# EAGLE design Pi (EAGLE 7.6.0)
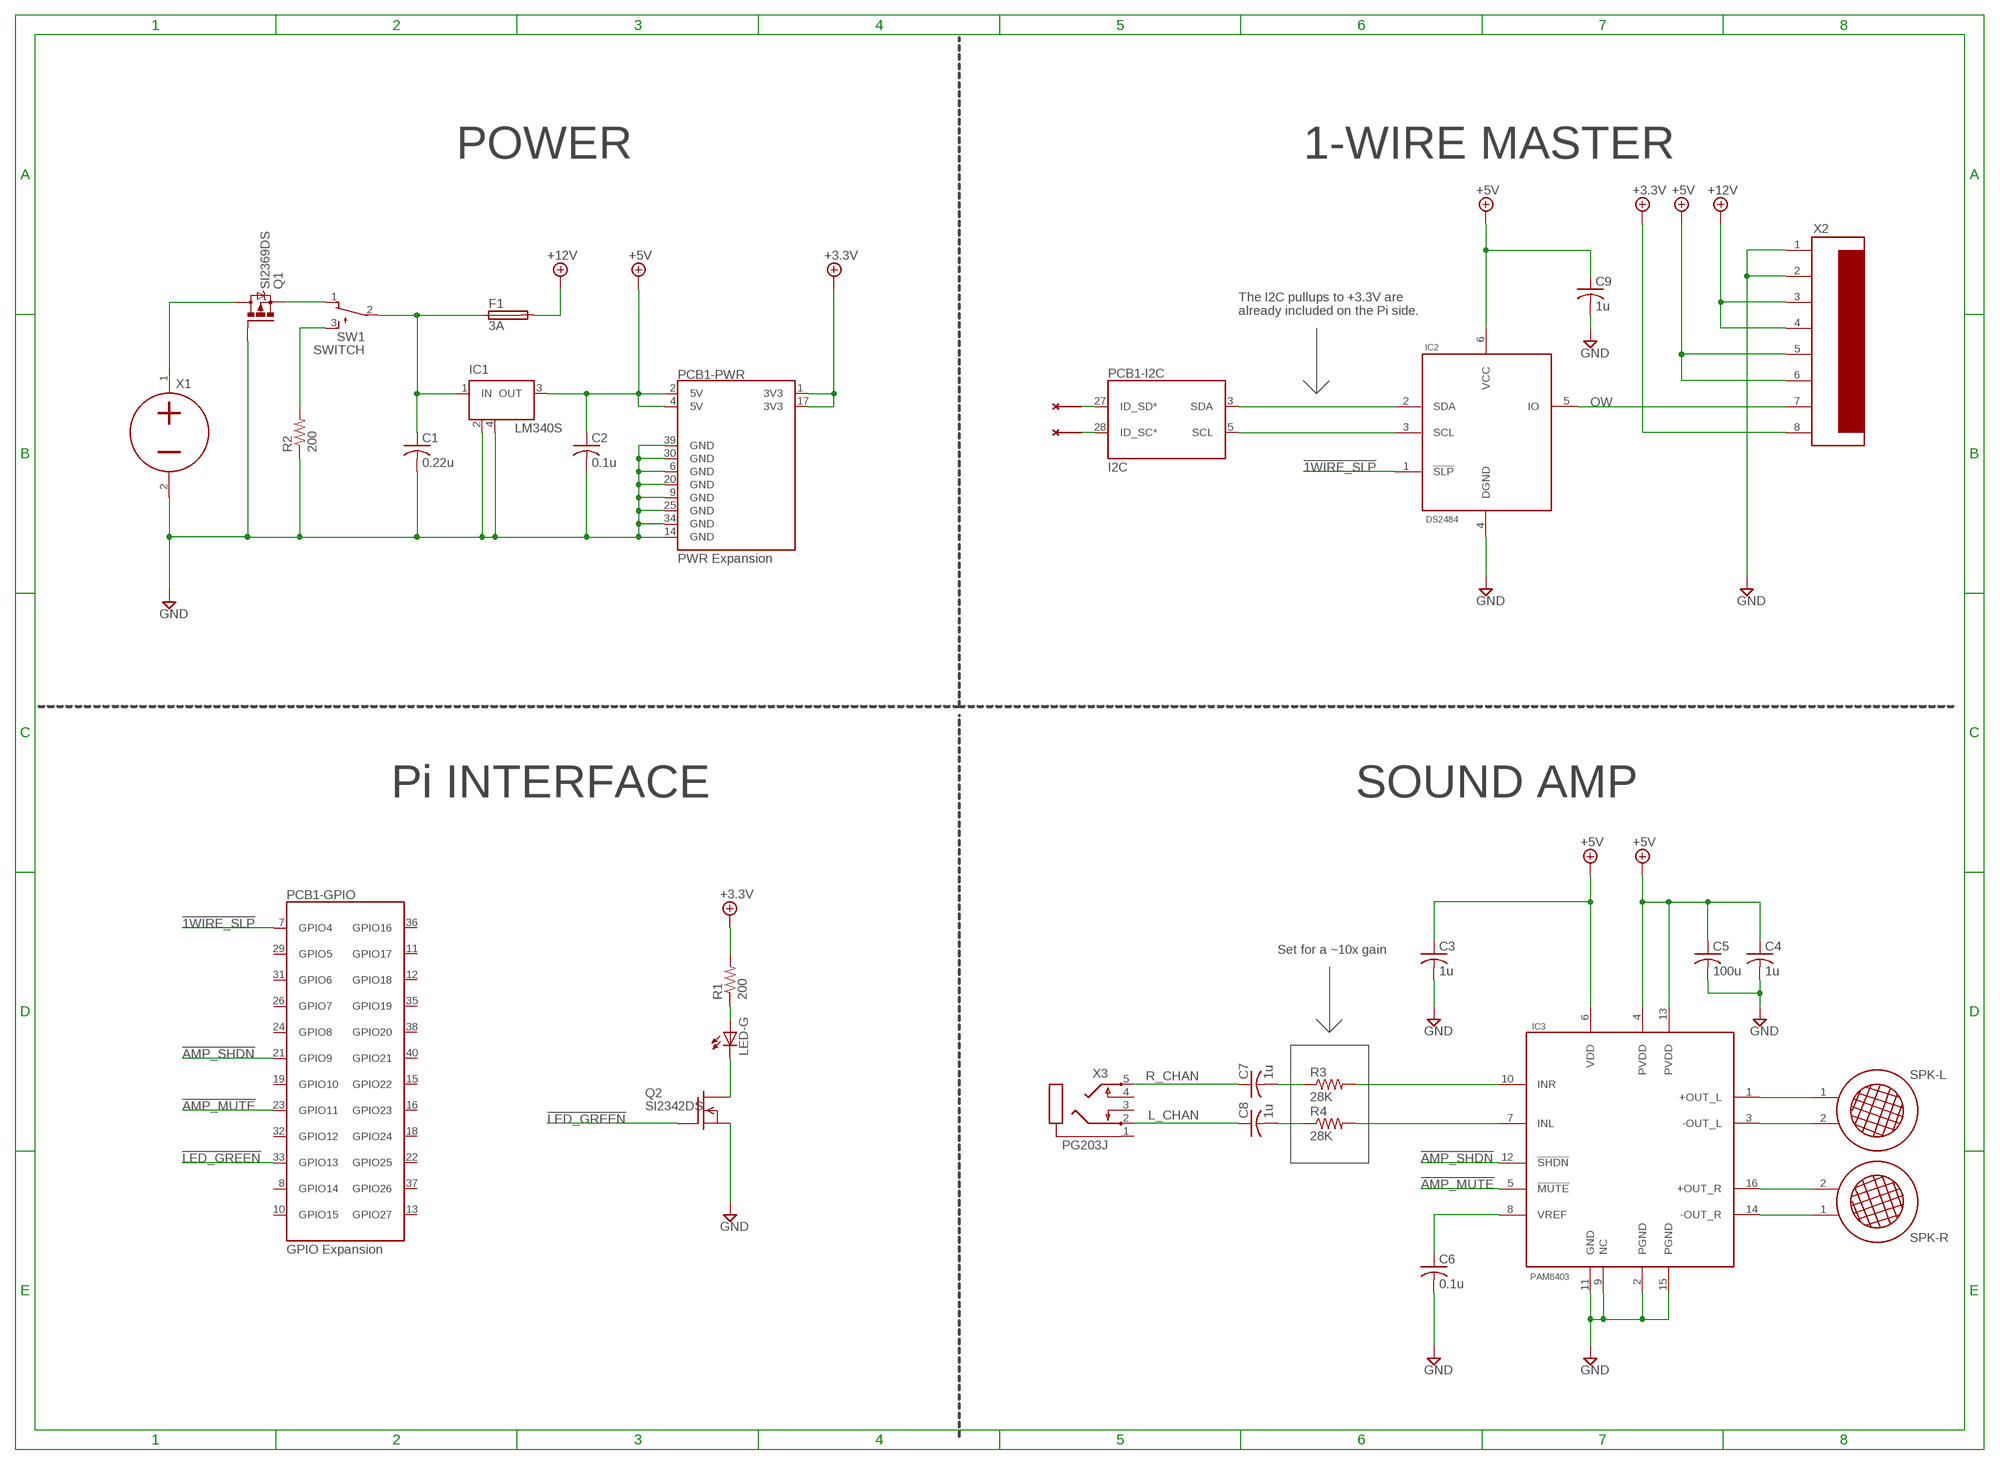
[diagram p0: schematic, sheet 1]

## Parts
C1  0.22u  C-USC0603  [C0603]
C2  0.1u  C-USC0603  [C0603]
C3  1u  C-USC0603  [C0603]
C4  1u  C-USC0603  [C0603]
C5  100u  C-USC0805  [C0805]
C6  0.1u  C-USC0603  [C0603]
C7  1u  C-USC0603  [C0603]
C8  1u  C-USC0603  [C0603]
C9  1u  C-USC0603  [C0603]
F1  3A  0603SFP300F  [F0603]
IC1  LM340S  [SOT223]
IC2  DS2484  [SOT23-6L]
IC3  PAM8403  [SOP16]
LED-G  LEDCHIP-LED0603  [CHIP-LED0603]
NC1  NC  (no package)
NC2  NC  (no package)
PCB1  RPI3  [RPI3]
Q1  SI2369DS  [SOT23]
Q2  SI2342DS  [SOT23]
R1  200  R-US_R0603  [R0603]
R2  200  R-US_R0603  [R0603]
R3  28K  R-US_R0603  [R0603]
R4  28K  R-US_R0603  [R0603]
SPK-L  SPEAKER  [KK-156-2]
SPK-R  SPEAKER  [KK-156-2]
SW1  SWITCH  [KK-156-3]
X1  SUPPLY_12V  [KK-156-2]
X2  1WIRE-CON  [KK-156-8]
X3  PG203J  [PG203J]

## Nets
!1WIRE_SLP: IC2.1(!SLP) PCB1.7(-GPIO:GPIO4)
!AMP_MUTE: IC3.5(!MUTE) PCB1.23(-GPIO:GPIO11)
!AMP_SHDN: IC3.12(!SHDN) PCB1.21(-GPIO:GPIO9)
!LED_GREEN: PCB1.33(-GPIO:GPIO13) Q2.1(G)
+3P3V: PCB1.1(-PWR:3V3) PCB1.17(-PWR:3V3) R1.2 X2.8 ; supply symbol labelled +3.3V
+5V: C2.1 C3.1 C4.1 C5.1 C9.1 IC1.3(OUT) IC2.6(VCC) IC3.4(PVDD) IC3.6(VDD) IC3.13(PVDD) PCB1.2(-PWR:5V) PCB1.4(-PWR:5V) X2.5 X2.6
+12V: F1.2 X2.3 X2.4
GND: C1.2 C2.2 C3.2 C4.2 C5.2 C6.2 C9.2 IC1.2(GND) IC1.4(GND) IC2.4(DGND) IC3.2(PGND) IC3.9(NC) IC3.11(GND) IC3.15(PGND) PCB1.6(-PWR:GND) PCB1.9(-PWR:GND) PCB1.14(-PWR:GND) PCB1.20(-PWR:GND) PCB1.25(-PWR:GND) PCB1.30(-PWR:GND) PCB1.34(-PWR:GND) PCB1.39(-PWR:GND) Q1.1(G) Q2.2(S) R2.1 X1.2 X2.1 X2.2
L_CHAN: C8.1 X3.2
N$1: LED-G.A R1.1
N$2: R2.2 SW1.3(S)
N$3: NC1.P$1 PCB1.27(-I2C:ID_SD*)
N$4: NC2.P$1 PCB1.28(-I2C:ID_SC*)
N$5: IC2.2(SDA) PCB1.3(-I2C:SDA)
N$6: IC2.3(SCL) PCB1.5(-I2C:SCL)
N$8: C6.1 IC3.8(VREF)
N$9: Q1.3(D) X1.1
N$10: Q1.2(S) SW1.1(O)
N$11: C7.2 R3.1
N$12: IC3.10(INR) R3.2
N$13: C1.1 F1.1 IC1.1(IN) SW1.2(P)
N$14: C8.2 R4.1
N$15: IC3.7(INL) R4.2
N$16: IC3.1(+OUT_L) SPK-L.1
N$17: IC3.3(-OUT_L) SPK-L.2
N$18: IC3.16(+OUT_R) SPK-R.2
N$19: IC3.14(-OUT_R) SPK-R.1
N$20: LED-G.C Q2.3(D)
OW: IC2.5(IO) X2.7
R_CHAN: C7.1 X3.5
Unconnected: PCB1.8(-GPIO:GPIO14) PCB1.10(-GPIO:GPIO15) PCB1.11(-GPIO:GPIO17) PCB1.12(-GPIO:GPIO18) PCB1.13(-GPIO:GPIO27) PCB1.15(-GPIO:GPIO22) PCB1.16(-GPIO:GPIO23) PCB1.18(-GPIO:GPIO24) PCB1.19(-GPIO:GPIO10) PCB1.22(-GPIO:GPIO25) PCB1.24(-GPIO:GPIO8) PCB1.26(-GPIO:GPIO7) PCB1.29(-GPIO:GPIO5) PCB1.31(-GPIO:GPIO6) PCB1.32(-GPIO:GPIO12) PCB1.35(-GPIO:GPIO19) PCB1.36(-GPIO:GPIO16) PCB1.37(-GPIO:GPIO26) PCB1.38(-GPIO:GPIO20) PCB1.40(-GPIO:GPIO21) X3.1 X3.3 X3.4

## Notes on the sheet
- POWER | 1-WIRE MASTER
- The I2C pullups to +3.3V are
  already included on the Pi side.
- Pi INTERFACE | SOUND AMP
- Set for a ~10x gain

## Library data of the parts
C1-C4 C6-C9 = resistor:C-US: CAPACITOR, American symbol
C5 = rcl:C-US: CAPACITOR, American symbol
F1 = Common:0603SFP300F: Fuse
IC1 = linear:LM340S: 3-Terminal Positive Regulators Source: http://cache.national.com/ds/LM/LM340.pdf
IC2 = Custom:DS2484
IC3 = Custom:PAM8403: RTD to Digital Converter The MAX31865 is a resistance-to-digital converter optimized for platinum resistance temperature detectors (RTDs). An external resistor sets the sensitivity for the RTD being used and a delta-sigma ADC converts the ratio of the RTD resistance to the reference resistance into digital form. The MAX31865’s inputs are protected against overvoltage faults up to +/-50V. Programmable detection of RTD and cable open and short conditions is included.
LED-G = led:LED: LED OSRAM: - CHIPLED LG R971, LG N971, LY N971, LG Q971, LY Q971, LO R971, LY R971 LH N974, LH R974 LS Q976, LO Q976, LY Q976 LO Q996 - Hyper CHIPLED LW Q18S LB Q993, LB Q99A, LB R99A - SideLED LS A670, LO A670, LY A670, LG A670, LP A670 LB A673, LV A673, LT A673, LW A673 LH A674 LY A675 LS A676, LA A676, LO A676, LY A676, LW A676 LS A679, LY A679, LG A679 - Hyper Micro SIDELED® LS Y876, LA Y876, LO Y876, LY Y876 LT Y87S - SmartLED LW L88C, LW L88S LB L89C, LB L89S, LG L890 LS L89K, LO L89K, LY L89K LS L896, LA L896, LO L896, LY L896 - TOPLED LS T670, LO T670, LY T670, LG T670, LP T670 LSG T670, LSP T670, LSY T670, LOP T670, LYG T670 LG T671, LOG T671, LSG T671 LB T673, LV T673, LT T673, LW T673 LH T674 LS T676, LA T676, LO T676, LY T676, LB T676, LH T676, LSB T676, LW T676 LB T67C, LV T67C, LT T67C, LS T67K, LO T67K, LY T67K, LW E67C LS E67B, LA E67B, LO E67B, LY E67B, LB E67C, LV E67C, LT E67C LW T67C LS T679, LY T679, LG T679 LS T770, LO T770, LY T770, LG T770, LP T770 LB T773, LV T773, LT T773, LW T773 LH T774 LS E675, LA E675, LY E675, LS T675 LS T776, LA T776, LO T776, LY T776, LB T776 LHGB T686 LT T68C, LB T68C - Hyper Mini TOPLED® LB M676 - Mini TOPLED Santana® LG M470 LS M47K, LO M47K, LY M47K Source: http://www.osram.convergy.de LUXEON: - LUMILED® LXK2-PW12-R00, LXK2-PW12-S00, LXK2-PW14-U00, LXK2-PW14-V00 LXK2-PM12-R00, LXK2-PM12-S00, LXK2-PM14-U00 LXK2-PE12-Q00, LXK2-PE12-R00, LXK2-PE12-S00, LXK2-PE14-T00, LXK2-PE14-U00 LXK2-PB12-K00, LXK2-PB12-L00, LXK2-PB12-M00, LXK2-PB14-N00, LXK2-PB14-P00, LXK2-PB14-Q00 LXK2-PR12-L00, LXK2-PR12-M00, LXK2-PR14-Q00, LXK2-PR14-R00 LXK2-PD12-Q00, LXK2-PD12-R00, LXK2-PD12-S00 LXK2-PH12-R00, LXK2-PH12-S00 LXK2-PL12-P00, LXK2-PL12-Q00, LXK2-PL12-R00 Source: www.luxeon.com KINGBRIGHT: KA-3528ASYC Source: www.kingbright.com
NC1 NC2 = Custom:NC: No Connect
PCB1 = Custom:RPI3: Raspberry Pi 3 expansion board.
Q1 = Common:SI2369DS: P-Channel 20-V (D-S) MOSFET Source: http://www.vishay.com/docs/72024/72024.pdf
Q2 = Custom:SI2342DS: N-Channel 8-V (D-S) MOSFET Source: http://www.vishay.com/docs/63302/si2342ds.pdf
R1-R4 = resistor:R-US_: RESISTOR, American symbol
SPK-L SPK-R = Custom:SPEAKER: PHOENIX CONNECTOR
SW1 = Custom:SWITCH: PHOENIX CONNECTOR
X1 = Custom:SUPPLY_12V: PHOENIX CONNECTOR
X2 = Custom:1WIRE-CON: KK 156 HEADER Source: http://www.molex.com/pdm_docs/sd/026604100_sd.pdf; OC_FARNELL: unknown; OC_NEWARK: unknown
X3 = con-hirschmann:PG203J: MIC/HEADPHONE JACK KS-S stereo microphone/headphone jack PG203JN (Schukat); OC_FARNELL: unknown; OC_NEWARK: unknown

## Net classes
1 hv_pwr: width 0.813 mm, drill 0.508 mm, clearance 0.254 mm
2 lv_pwr: width 0.406 mm, drill 0.508 mm, clearance 0.254 mm
3 signal: width 0.254 mm, drill 0.254 mm, clearance 0.127 mm

## Board
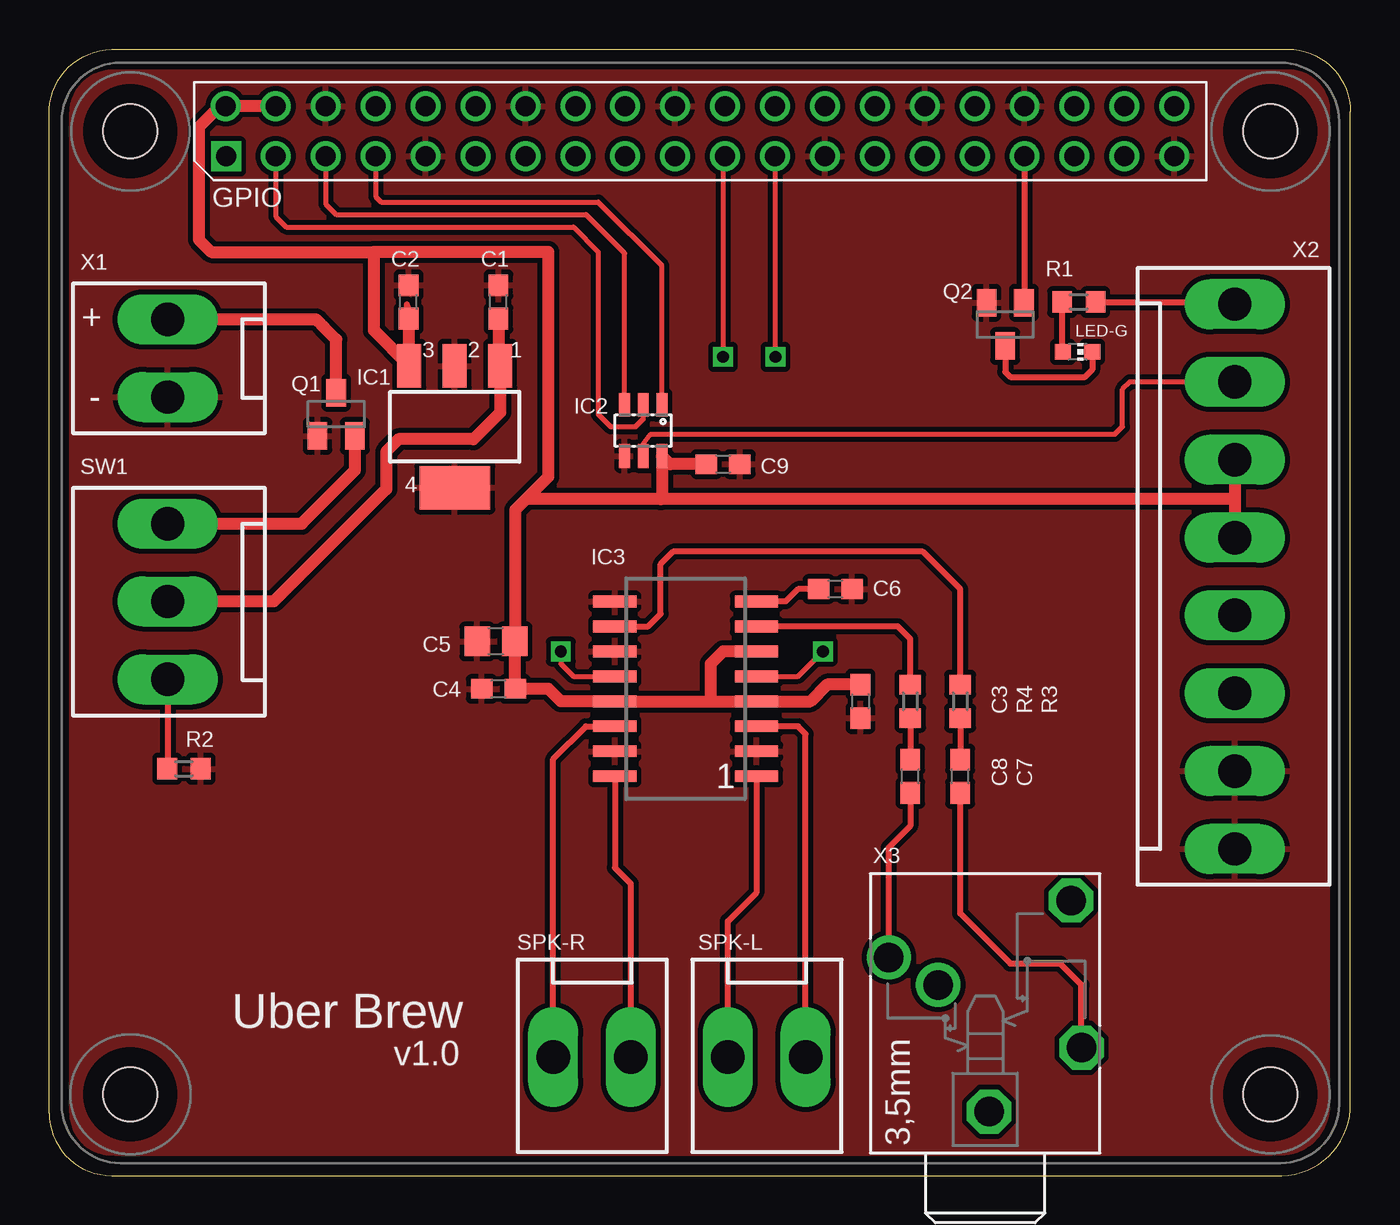
[diagram p1: board, top side]
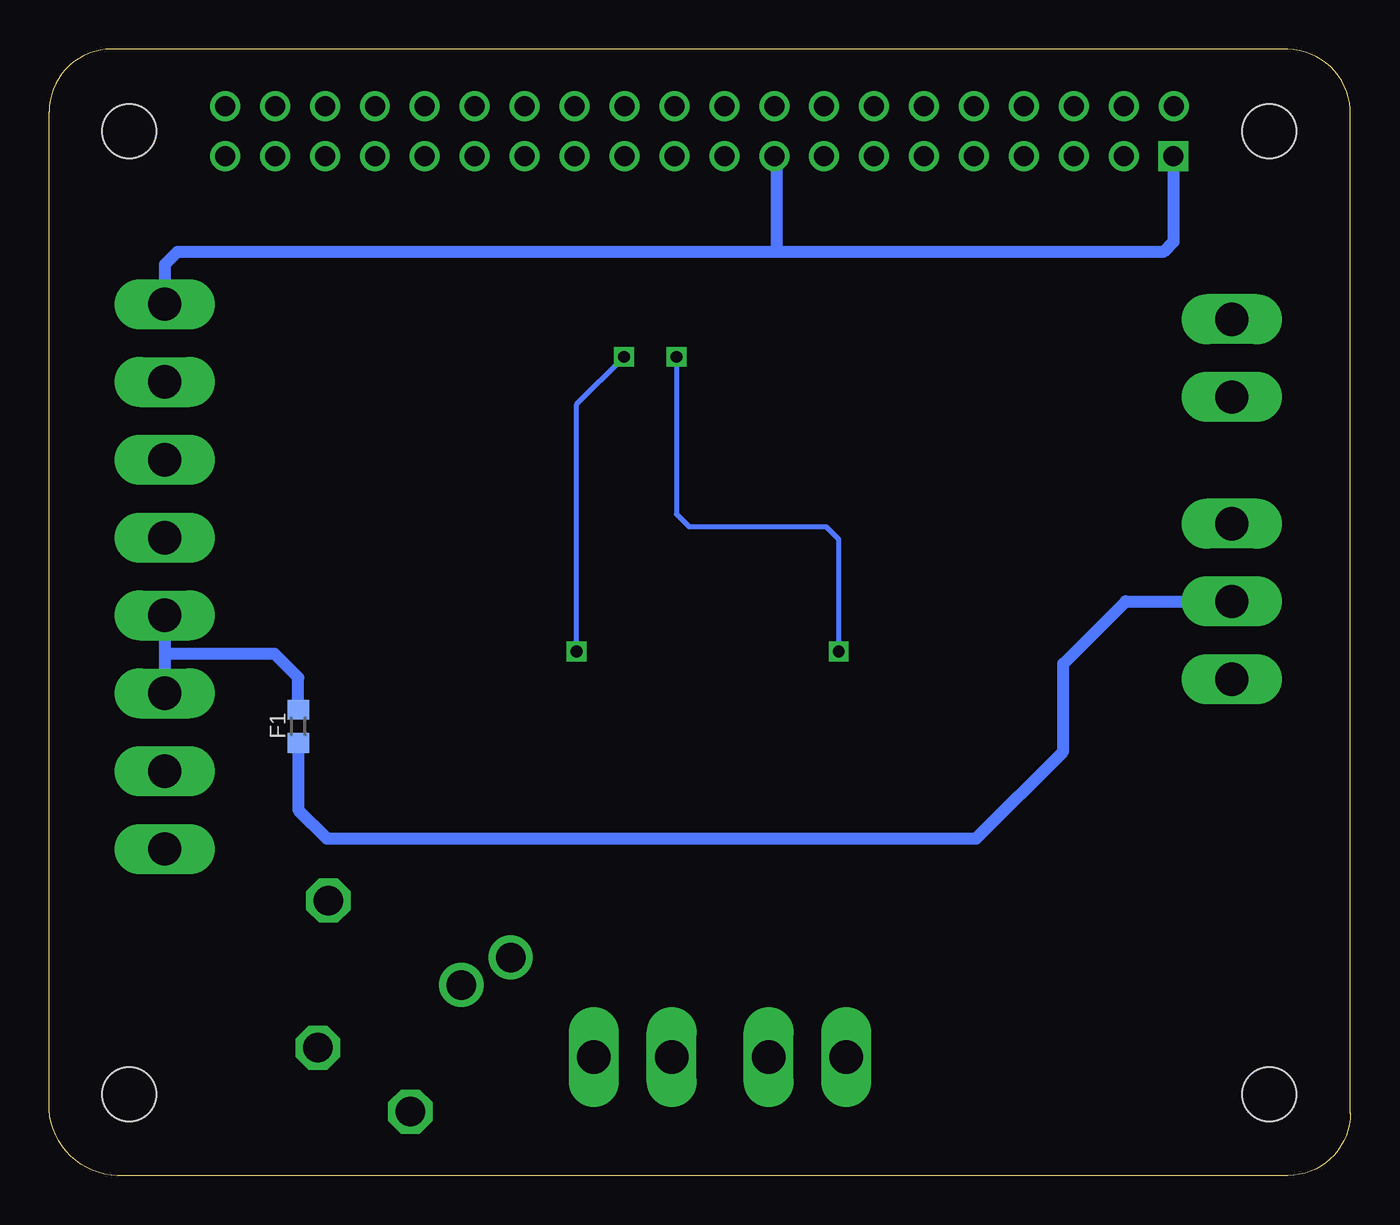
[diagram p2: board, bottom side, seen from below]

Size 66.21 x 57.32 mm. Coordinates in mm from the lower left corner, seen from the top.
Outline: 0,3.18 0,53.98 arc-90 3.17,57.32 63.03,57.32 arc-90 66.2,54.15 66.2,3.35 arc-90 62.39,0.01 3.17,0.01 arc-90 0,3.18
Copper layers (1*16): Top 0.035mm / dielectric 1.5mm / Bottom 0.035mm
Design rules "default *": minimum track width 10mil, minimum drill 20mil, track to track 8mil, track to pad 8mil, pad to pad 8mil, via to via 8mil, smd to smd 8mil, copper to edge 40mil, drill to drill 8mil, minimum pad ring 10mil, minimum via ring 8mil, stop-mask expansion 4mil, vias tented up to drill 0mil, thermal gap 10mil

### Footprints (pad centres in the part's own frame; a part is rotated, then mirrored left to right if it is on the bottom)
C0603 = smd 1.1 x 1: 1 -0.85,0; 2 0.85,0
C0805 = smd 1.3 x 1.5: 1 -0.95,0; 2 0.95,0
F0603 = smd 1 x 1.1: 1 -0.85,0; 2 0.85,0
SOT223 = smd 1.219 x 2.235: 1 -2.311,-3.099; 2 0,-3.099; 3 2.311,-3.099 | smd 3.6 x 2.2: 4 0,3.099
SOT23-6L = smd 0.55 x 1.2: 1 -0.95,-1.3; 2 0,-1.3; 3 0.95,-1.3; 4 0.95,1.3; 5 0,1.3; 6 -0.95,1.3
SOP16 = smd 0.6 x 2.2: 1 -4.445,-3.6; 2 -3.175,-3.6; 3 -1.905,-3.6; 4 -0.635,-3.6; 5 0.635,-3.6; 6 1.905,-3.6; 7 3.175,-3.6; 8 4.445,-3.6; 9 4.445,3.6; 10 3.175,3.6; 11 1.905,3.6; 12 0.635,3.6; 13 -0.635,3.6; 14 -1.905,3.6; 15 -3.175,3.6; 16 -4.445,3.6
CHIP-LED0603 = smd 0.8 x 0.8: A 0,-0.75; C 0,0.75
RPI3 = drill 1.016 square: 1 8.37,51.23 | drill 1.016: 2 8.357,53.772; 3 10.897,51.232; 4 10.897,53.772; 5 13.437,51.232; 6 13.437,53.772; 7 15.977,51.232; 8 15.977,53.772; 9 18.517,51.232; 10 18.517,53.772; 11 21.057,51.232; 12 21.057,53.772; 13 23.597,51.232; 14 23.597,53.772; 15 26.137,51.232; 16 26.137,53.772; 17 28.677,51.232; 18 28.677,53.772; 19 31.217,51.232; 20 31.217,53.772; 21 33.757,51.232; 22 33.757,53.772; 23 36.297,51.232; 24 36.297,53.772; 25 38.837,51.232; 26 38.837,53.772; 27 41.377,51.232; 28 41.377,53.772; 29 43.917,51.232; 30 43.917,53.772; 31 46.457,51.232; 32 46.457,53.772; 33 48.997,51.232; 34 48.997,53.772; 35 51.537,51.232; 36 51.537,53.772; 37 54.077,51.232; 38 54.077,53.772; 39 56.617,51.232; 40 56.617,53.772 | hole 2.75: 3.5,3.5; 61.5,3.5; 3.5,52.5; 61.5,52.5
SOT23 = smd 1 x 1.4: 1 -0.95,-1.1; 2 0.95,-1.1; 3 0,1.1
R0603 = smd 1 x 1.1: 1 -0.85,0; 2 0.85,0
KK-156-2 = drill 1.7 pad 2.184 long: 1 -1.98,0; 2 1.98,0
KK-156-3 = drill 1.7 pad 2.184 long: 1 -3.96,0; 2 0,0; 3 3.96,0
KK-156-8 = drill 1.7 pad 2.184 long: 1 -13.86,0; 2 -9.9,0; 3 -5.94,0; 4 -1.98,0; 5 1.98,0; 6 5.94,0; 7 9.9,0; 8 13.86,0
PG203J = drill 1.499 octagon: 1 -5.004,-0.203; 4 5.74,-4.369; 5 -1.753,-4.902 | drill 1.499: 2 2.845,4.902; 3 1.448,2.388

### Placement (x,y rotation side)
C1  22.86,44.46 90 top
C2  18.29,44.46 90 top
C3  41.27,24.14 270 top
C4  22.86,24.77 180 top
C5  22.73,27.18 180 top
C6  40,29.85 0 top
C7  46.35,20.33 90 top
C8  43.81,20.33 90 top
C9  34.29,36.2 0 top
F1  53.53,22.87 90 bottom
IC1  20.64,38.11 180 top
IC2  30.23,37.92 180 top
IC3  32.38,24.77 90 top
LED-G  52.32,41.92 270 top
PCB1  0.64,0.64 0 top
Q1  14.61,38.74 0 top
Q2  48.64,43.31 180 top
R1  52.39,44.46 0 top
R2  6.86,20.71 180 top
R3  46.35,24.14 90 top
R4  43.81,24.14 90 top
SPK-L  36.51,6.04 0 top
SPK-R  27.62,6.04 0 top
SW1  6.03,29.22 270 top
X1  6.03,41.6 270 top
X2  60.32,30.49 90 top
X3  47.62,8.26 90 top

### Tracks (layer width: path | path; a pad name or v marks a point on that pad's centre or on a via)
!1WIRE_SLP
  Top 0.254: IC2.1 31.18,46.3 27.94,49.54 16.89,49.54 16.61,49.82 PCB1.7
!AMP_MUTE  (via drill 0.6)
  Top 0.254: IC3.5 38.1,25.41 v39.37,26.68 | v36.96,41.66 36.96,51.85 PCB1.23
  Bottom 0.254: v39.37,26.68 39.37,39.25 v36.96,41.66
!AMP_SHDN  (via drill 0.6)
  Top 0.254: PCB1.21 34.29,51.87 v34.29,41.66 | v26.04,26.68 26.04,26.04 26.67,25.41 IC3.12
  Bottom 0.254: v34.29,41.66 34.29,33.66 33.66,33.03 26.67,33.03 26.04,32.39 v26.04,26.68
!LED_GREEN
  Top 0.305: PCB1.33 49.63,44.45 Q2.1
+3P3V
  Top 0.305: R1.2 60.21,44.46 X2.8
  Bottom 0.61: PCB1.1 9,47.52 9.53,47 29.21,47 | 29.21,47 59.69,47 60.32,46.36 X2.8 | PCB1.17 29.21,51.87 29.21,47
+5V
  Top 0.254: 31.18,34.48 31.12,34.42
  Top 0.305: 18.2,44.33 C2.1 18.25,44.2
  Top 0.406: 25.46,37.41 25.4,37.47
  Top 0.61: C2.1 18.29,41.24 IC1.3 16.51,43.02 16.51,47 | PCB1.4 PCB1.2 8.69,54.41 7.62,53.35 7.62,47.63 8.26,47 16.51,47 | 33.66,24.14 IC3.13 26.04,24.14 25.4,24.77 C4.1 23.68,24.8 C5.1 23.71,27.21 23.71,33.88 24.26,34.42 | 33.66,24.14 IC3.4 38.73,24.14 39.59,24.99 C3.1 | IC3.6 34.29,26.68 33.66,26.04 33.66,24.14 | 24.26,34.42 25.4,35.57 25.4,37.47 25.4,47 16.51,47 | X2.6 60.32,34.42 | 60.32,34.42 X2.5 | 60.32,34.42 31.12,34.42 24.26,34.42 | 31.18,34.48 IC2.6 31.59,36.2 C9.1
+12V
  Bottom 0.61: X2.4 60.32,26.55 | 60.32,26.55 X2.3 | F1.2 53.53,25.34 54.74,26.55 60.32,26.55
GND
  pour Top (isolate 0.254, rank 2): -0.64,57.79 -0.64,-0.63 66.68,-0.63 66.68,57.79
L_CHAN
  Top 0.305: X3.2 42.72,16.69 43.81,17.79 C8.1
N$1
  Top 0.305: R1.1 51.54,41.95 LED-G.A
N$2
  Top 0.305: SW1.3 6.03,20.73 R2.2
N$5
  Top 0.254: PCB1.3 11.53,48.8 12.06,48.27 26.67,48.27 27.94,47 27.94,38.74 28.58,38.11 29.85,38.11 30.23,38.49 IC2.2
N$6
  Top 0.254: PCB1.5 14.07,49.43 14.61,48.9 27.31,48.9 29.28,46.93 IC2.3
N$8
  Top 0.305: C6.1 38.1,29.85 37.46,29.22 IC3.8
N$9
  Top 0.61: X1.1 13.58,43.58 13.65,43.5 13.97,43.19 14.61,42.55 Q1.3
N$10
  Top 0.61: Q1.2 15.55,35.88 12.85,33.18 SW1.1
N$11
  Top 0.305: R3.1 C7.2
N$12
  Top 0.305: IC3.10 30.48,27.95 31.12,28.58 31.12,31.12 31.75,31.76 44.45,31.76 46.35,29.85 R3.2
N$13
  Top 0.61: SW1.2 11.43,29.22 17.15,34.93 17.15,36.84 17.78,37.47 21.59,37.47 22.95,38.83 IC1.1 22.86,41.29 C1.1
  Bottom 0.61: SW1.2 11.43,29.22 14.61,26.04 14.61,21.6 19.05,17.15 52.07,17.15 53.53,18.61 F1.1
N$14
  Top 0.305: R4.1 C8.2
N$15
  Top 0.305: R4.2 43.81,27.31 43.18,27.95 IC3.7
N$16
  Top 0.305: IC3.1 35.98,14.4 34.53,12.95 SPK-L.1
N$17
  Top 0.305: SPK-L.2 38.49,22.47 38.1,22.87 IC3.3
N$18
  Top 0.305: IC3.16 28.79,15.67 29.6,14.85 SPK-R.2
N$19
  Top 0.305: SPK-R.1 25.64,21.2 27.31,22.87 IC3.14
N$20
  Top 0.305: Q2.3 48.64,40.9 48.89,40.65 52.7,40.65 53.07,41.02 LED-G.C
OW
  Top 0.254: IC2.5 30.23,37.22 30.61,37.73 54.23,37.73 54.61,38.11 54.61,40.01 54.98,40.39 X2.7
  Top 0.305: X2.7
R_CHAN
  Top 0.305: X3.5 52.53,9.71 51.43,10.8 48.89,10.8 46.35,13.34 C7.1

### Text on the board
tPlace: + | - | Uber Brew | v1.0